# Altium schematic sheet StepDown_5V_MT2484.SchDoc
size A4
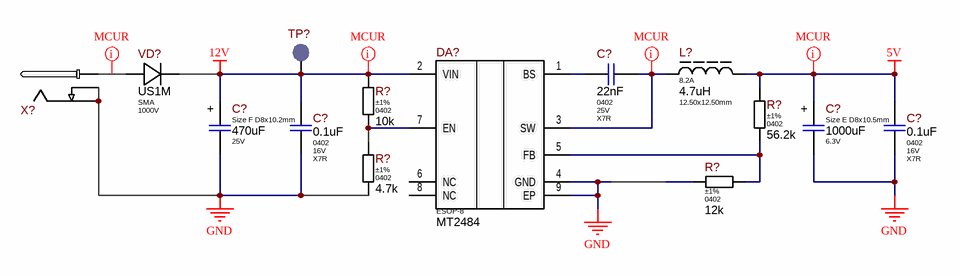
[diagram p0: StepDown_5V_MT2484.SchDoc]

## Parts
(Parts that share a designator on the sheet are numbered #1, #2 ... from top to bottom, then left to right.)
C?#1  Package: 0402  Voltage: 25V  Dielectric Type: X7R  [C_CERAMIC_0402_MED]  (hidden comment: 22nF)
C?#2  value 470uF  Package: Size F D8x10.2mm  Voltage: 25V  [CAP-AE-830x1020H30_MED]  (hidden comment: 470uFx25V)
C?#3  Package: 0402  Voltage: 16V  Dielectric Type: X7R  [C_CERAMIC_0402_MED]  (hidden comment: 0.1uF)
C?#4  value 1000uF  Package: Size E D8x10.5mm  Voltage: 6.3V  [CAP-AE-840x1050H30_MED]  (hidden comment: 1000uFx6.3V)
C?#5  Package: 0402  Voltage: 16V  Dielectric Type: X7R  [C_CERAMIC_0402_MED]  (hidden comment: 0.1uF)
DA?  Package: ESOP-8  [MT2484_MED]  (hidden comment: MT2484)
L?  Current: 8.2A  Package: 12.50x12.50mm  [PM127SH-Series]  (hidden comment: 4.7uH)
R?#1  Tolerance: ±1%  Package: 0402  [R_ANY_CHIP_0402_MED]  (hidden comment: 10k)
R?#2  Tolerance: ±1%  Package: 0402  [R_ANY_CHIP_0402_MED]  (hidden comment: 56.2k)
R?#3  Tolerance: ±1%  Package: 0402  [R_ANY_CHIP_0402_MED]  (hidden comment: 4.7k)
R?#4  Tolerance: ±1%  Package: 0402  [R_ANY_CHIP_0402_MED]  (hidden comment: 12k)
TP?  Test Point  [TP_SMD_1.5mm]  (value not drawn)  (no BOM)
VD?  Package: SMA  Voltage: 1000V  [SMA_MED]  (hidden comment: US1M)
X?  KLS1-DC-005A-2.0  [KLS1-DC-005A-2.0]  (value not drawn)

## Nets
5V: C?#4.1 C?#5.1 L?.2 R?#2.1
12V: C?#2.1 C?#3.1 DA?.2(VIN) R?#1.1 TP?.1 VD?.CA
GND: C?#2.2 C?#3.2 C?#4.2 C?#5.2 DA?.4(GND) DA?.9(EP) R?#3.2 R?#4.2 X?.2 X?.3
NetC?#1_1: C?#1.1 DA?.1(BS)
NetC?#1_2: C?#1.2 DA?.3(SW) L?.1
NetDA?_5: DA?.5(FB) R?#2.2 R?#4.1
NetDA?_7: DA?.7(EN) R?#1.2 R?#3.1
NetVD?_AN: VD?.AN X?.1

Not connected (* = marked no-connect by the designer): DA? 6(NC) 8(NC)

## Layout directives
net class MiddleCurrent: 5V, 12V, NetC?#1_2, NetVD?_AN

## Notes on the sheet
- (in symbol EEE-FT1E471AL) +
- (in symbol EZV102M0JRE) +

## Library data of the parts
C?#1 = GRM155R71E223JA61D: 22nF 25V X7R ±5% 0402 Ceramic Capacitor RoHS; Manufacturer: Murata Electronics; Ajax_1C_ID: 7793; Ajax_1C_PN: 22nF X7R 5% 25V 0402 GRM155R71E223JA61D Ceramic Capacitor SMD RoHS; Standard Lead Time: 15 Weeks; Component Status: Released; Replacement: NONE; GUID_1C: 64b51ea1-d64d-11e5-814a-d8cb8a9acc66; Ajax_1С_Status: Mass Production; Value: 22nF; Part Number: GRM155R71E223JA61D; Part Type: Ceramic / X7R / 0402; Component Type: SMD; Temperature Range: -55°C ~ 125°C; Tolerance: ±5%; ComponentLink1URL: https://search.murata.co.jp/Ceramy/image/img/A01X/G101/ENG/GRM155R71E223KA61-01.pdf; Supplier 1: Digi-Key; Supplier Part Number 1: 490-10699-1-ND; ComponentLink1Description: Datasheet; Price: 0,00388
C?#2 = EEE-FT1E471AL: 470uF 25V ±20% Size F D8x10.2mm SMD Low ESR Aluminum Electrolytic Capacitor; Manufacturer: Panasonic; Ajax_1C_PN: 470uF 25V 20% SMD sizeF 8x10.2 EEE-FT1E471AL; Standard Lead Time: 35 Weeks; Component Status: Released; Dielectric Type: NONE; Ajax_1C_ID: 30494; Ajax_1С_Status: RND Only; GUID_1C: 4e833aad-c537-11eb-ab74-0050569f2651; Part Number: EEE-FT1E471AL; Part Type: Aluminum; Component Type: SMD; Temperature Range: -55°C ~ 105°C; Tolerance: ±20%; ComponentLink1URL: https://eu.mouser.com/datasheet/2/315/panasonic_05052020_Capacitor_Lytic_SMD_Halogen_Fre-1843155.pdf; Supplier 1: Mouser; Supplier Part Number 1: 667-EEE-FT1E471AL; Replacement: NONE; ComponentLink1Description: Datasheet; Price: 0,957
C?#3 C?#5 = CC0402KRX7R7BB104: 100nF 16V X7R ±10% 0402 Ceramic Capacitor RoHS; Manufacturer: Yageo; Ajax_1C_ID: 13183; Ajax_1C_PN: 100nF 16V X7R 10% 0402 CC0402KRX7R7BB104 Ceramic Capacitor SMD RoHS; Standard Lead Time: 33 Weeks; Component Status: Released; Replacement: NONE; GUID_1C: 31172856-89aa-11e8-ab42-0050569f2651; Ajax_1С_Status: Mass Production; Value: 0.1uF; Part Number: CC0402KRX7R7BB104; Part Type: Ceramic / X7R / 0402; Component Type: SMD; Temperature Range: -55°C ~ 125°C; Tolerance: ±10%; ComponentLink1URL: https://www.yageo.com/upload/media/product/productsearch/datasheet/mlcc/UPY-GPHC_X7R_6.3V-to-50V_18.pdf; Supplier 1: Digi-Key; Supplier Part Number 1: 311-1338-2-ND; ComponentLink1Description: Datasheet; Price: 0,01660238
C?#4 = EZV102M0JRE: 1000uF 6.3V ±20% Size E D8x10.5 SMD Electrolytic Low Impedance Capacitor; Manufacturer: Hitano; Ajax_1C_PN: 1000uF 6,3V EZV SMD sizeE 8x10.5 (low imp.) (EZV102M0JRE); Standard Lead Time: NONE; Component Status: Released; Ajax_1C_ID: 6297; Ajax_1С_Status: Mass Production; GUID_1C: 05f5a37b-e418-11e4-9f89-a45d36c4a9e5; Part Number: EZV102M0JRE; Part Type: Aluminum; Component Type: SMD; Temperature Range: -55°C ~ 105°C; Tolerance: ±20%; Dielectric Type: NONE; ComponentLink1URL: https://www.hitano.com.tw/wp-content/uploads/doc/EZV_20200312.pdf; Replacement: NONE; ComponentLink1Description: Datasheet; Price: 0,093
DA? = MT2484: 1.2M/600kHz, 18V，3A Synchronous Step-Down Converter; Manufacturer: Aerosemi; Ajax_1C_ID: 10286; Ajax_1C_PN: MT2484 микросхема; Component Status: Released; Replacement: NONE; GUID_1C: e3920828-55b9-11e7-810b-14dda9d2d04d; Ajax_1С_Status: RND Only; Part Number: MT2484; Part Type: Power / DC-DC / Buck; Component Type: SMD; Temperature Range: -40°C ~ 85°C; ComponentLink1URL: https://www.dzsc.com/uploadfile/company/302185/2012718131030957.pdf; ComponentLink1Description: Datasheet; Price: 0,3
L? = PM127SH-4R7N-RC: 4.7uH Shielded Wirewound Inductor 8.2A 15.5mOhm Max; Manufacturer: Bourns Inc; Ajax_1C_ID: 10061; Ajax_1C_PN: 4.7uH PM127SH-4R7N-RC индуктивность; Saturation Current: 8.8A; Tolerance: ±20%; Component Status: Released; Standard Lead Time: 18 Weeks; Replacement: NONE; Ajax_1С_Status: RND Only; GUID_1C: 1b8848bc-417c-11e7-80f0-14dda9d2d04d; Value: 4.7uH; Part Number: PM127SH-4R7N-RC; Part Type: Power / Ferrite Core; Component Type: SMD; Temperature Range: -40°C ~ 125°C; ComponentLink1URL: https://www.bourns.com/docs/Product-Datasheets/PM127SH_SERIES.pdf; Supplier 1: Digi-Key; Supplier Part Number 1: PM127SH-4R7N-RCTR-ND; ComponentLink1Description: Datasheet; Price: 0,702
R?#1 = RC0402FR-0710KL: 10 kOhms ±1% 1/16W 0402 Thick Film Resistor; Manufacturer: Yageo; Ajax_1C_ID: 6717; Ajax_1C_PN: 10k 1% 0402 Resistors SMD RoHS; Component Status: Released; Power Rating: 0.062W; Voltage: 50V; Temperature Stability: ±100ppm/°C; Replacement: NONE; GUID_1C: 2e173059-2610-11e5-ad28-a45d36c4a9e5; Ajax_1С_Status: Mass Production; Value: 10k; Part Number: RC0402FR-0710KL; Component Type: SMD; Temperature Range: -55°C ~ 155°C; ComponentLink1URL: https://eu.mouser.com/datasheet/2/447/PYu_RC_Group_51_RoHS_L_10-1664068.pdf; ComponentLink1Description: Datasheet; Supplier 1: Digi-Key; Supplier Part Number 1: 311-10.0KLRTR-ND; Price: 0,00065; Part Type: Thick Film
R?#2 = RC0402FR-0756K2L: 56.2 kOhms ±1% 1/16W 0402 Thick Film Resistor; Manufacturer: Yageo; Ajax_1C_ID: 20241; Ajax_1C_PN: 56.2k 1% 0402 Resistors SMD RoHS; Component Status: Released; Power Rating: 0.062W; Voltage: 50V; Temperature Stability: ±100ppm/°C; Replacement: NONE; GUID_1C: 73881b35-8945-11ea-ab60-0050569f2651; Ajax_1С_Status: Mass Production; Value: 56.2k; Part Number: RC0402FR-0756K2L; Component Type: SMD; Temperature Range: -55°C ~ 155°C; ComponentLink1URL: https://eu.mouser.com/datasheet/2/447/PYu_RC_Group_51_RoHS_L_11-1984063.pdf; Supplier 1: Digi-Key; Supplier Part Number 1: YAG3187TR-ND; ComponentLink1Description: Datasheet; Part Type: Thick Film; Price: 0,00065
R?#3 = RC0402FR-074K7L: 4.7 kOhms ±1% 1/16W 0402 Thick Film Resistor; Manufacturer: Yageo; Ajax_1C_ID: 6500; Ajax_1C_PN: 4.7k 1% 0402 Resistors SMD RoHS; Component Status: Released; Power Rating: 0.062W; Voltage: 50V; Temperature Stability: ±100ppm/°C; Replacement: NONE; GUID_1C: 2dad3add-fe1c-11e4-ad28-a45d36c4a9e5; Ajax_1С_Status: Mass Production; Value: 4.7k; Part Number: RC0402FR-074K7L; Component Type: SMD; Temperature Range: -55°C ~ 155°C; ComponentLink1URL: https://eu.mouser.com/datasheet/2/447/PYu_RC_Group_51_RoHS_L_10-1664068.pdf; ComponentLink1Description: Datasheet; Part Type: Thick Film; Price: 0,00078
R?#4 = RC0402FR-0712KL: 12 kOhms ±1% 1/16W 0402 Thick Film Resistor; Manufacturer: Yageo; Ajax_1C_ID: 6526; Ajax_1C_PN: 12k 1% 0402 Resistors SMD RoHS; Component Status: Released; Power Rating: 0.062W; Voltage: 50V; Temperature Stability: ±100ppm/°C; Replacement: NONE; GUID_1C: 90d56bfb-ffaa-11e4-ad28-a45d36c4a9e5; Ajax_1С_Status: Mass Production; Value: 12k; Part Number: RC0402FR-0712KL; Component Type: SMD; Temperature Range: -55°C ~ 155°C; ComponentLink1URL: https://eu.mouser.com/datasheet/2/447/PYu_RC_Group_51_RoHS_L_11-1984063.pdf; Supplier 1: Digi-Key; Supplier Part Number 1: 311-12.0KLRTR-ND; ComponentLink1Description: Datasheet; Part Type: Thick Film; Price: 0,00065
TP? = TP-PAD-SMD: Test Point SMD Pad 1.0mm/1.5mm/2mm; Manufacturer: Ajax Systems; Ajax_1C_PN: Not Applicable; Component Status: Released; Replacement: NONE; Ajax_1С_Status: RND Only; Part Number: TP-PAD-SMD; Part Type: Test Point; Component Type: SMD; Temperature Range: NONE; ComponentLink1URL: NONE; ComponentLink1Description: Datasheet; Price: NONE
VD? = US1M: Diode Standard 1000V 1A, 75ns, SMA; Manufacturer: Diodec Semiconductor; Ajax_1C_ID: 20461; Ajax_1C_PN: US1M-DIO 1.0A 1000V 75ns, диод; Ajax_1С_Status: Mass Production; Component Status: Released; Vf: 1.7V @ 1A; Replacement: NONE; GUID_1C: 3d137b04-96a6-11ea-ab61-0050569f2651; Part Number: US1M; Part Type: General; Component Type: SMD; Marking: US1M; Current: 1A; Temperature Range: -50°C ~ 150°C; ComponentLink1URL: https://diotec.com/request/datasheet/us1a.pdf; Supplier 1: Arrow; Supplier Part Number 1: US1M; Price: 0,02846339; ComponentLink1Description: Datasheet
X? = KLS1-DC-005A-2.0: Power Jack, ID 2.1mm OD 5.5mm, Right Angle; Manufacturer: CUI Devices; Ajax_1C_ID: 19484; Ajax_1C_PN: KLS1-DC-005А-2.0 разъем на плату, 2.0*5.5мм; Component Status: Released; Replacement: NONE; GUID_1C: 41de8811-58ad-11ea-ab5b-0050569f2651; Ajax_1С_Status: Mass Production; Part Number: KLS1-DC-005A-2.0; Part Type: Power Jack; Component Type: PTH; Temperature Range: -25°C ~ 85°C; ComponentLink1URL: \\altiumdb.ajax.local\files\Datasheet\Connectors\L-KLS1-DC-005A.pdf; ComponentLink1Description: Datasheet; Price: 0,04